# EAGLE design fanRegulator (EAGLE 7.6.0)

## Sheet 1 of 2
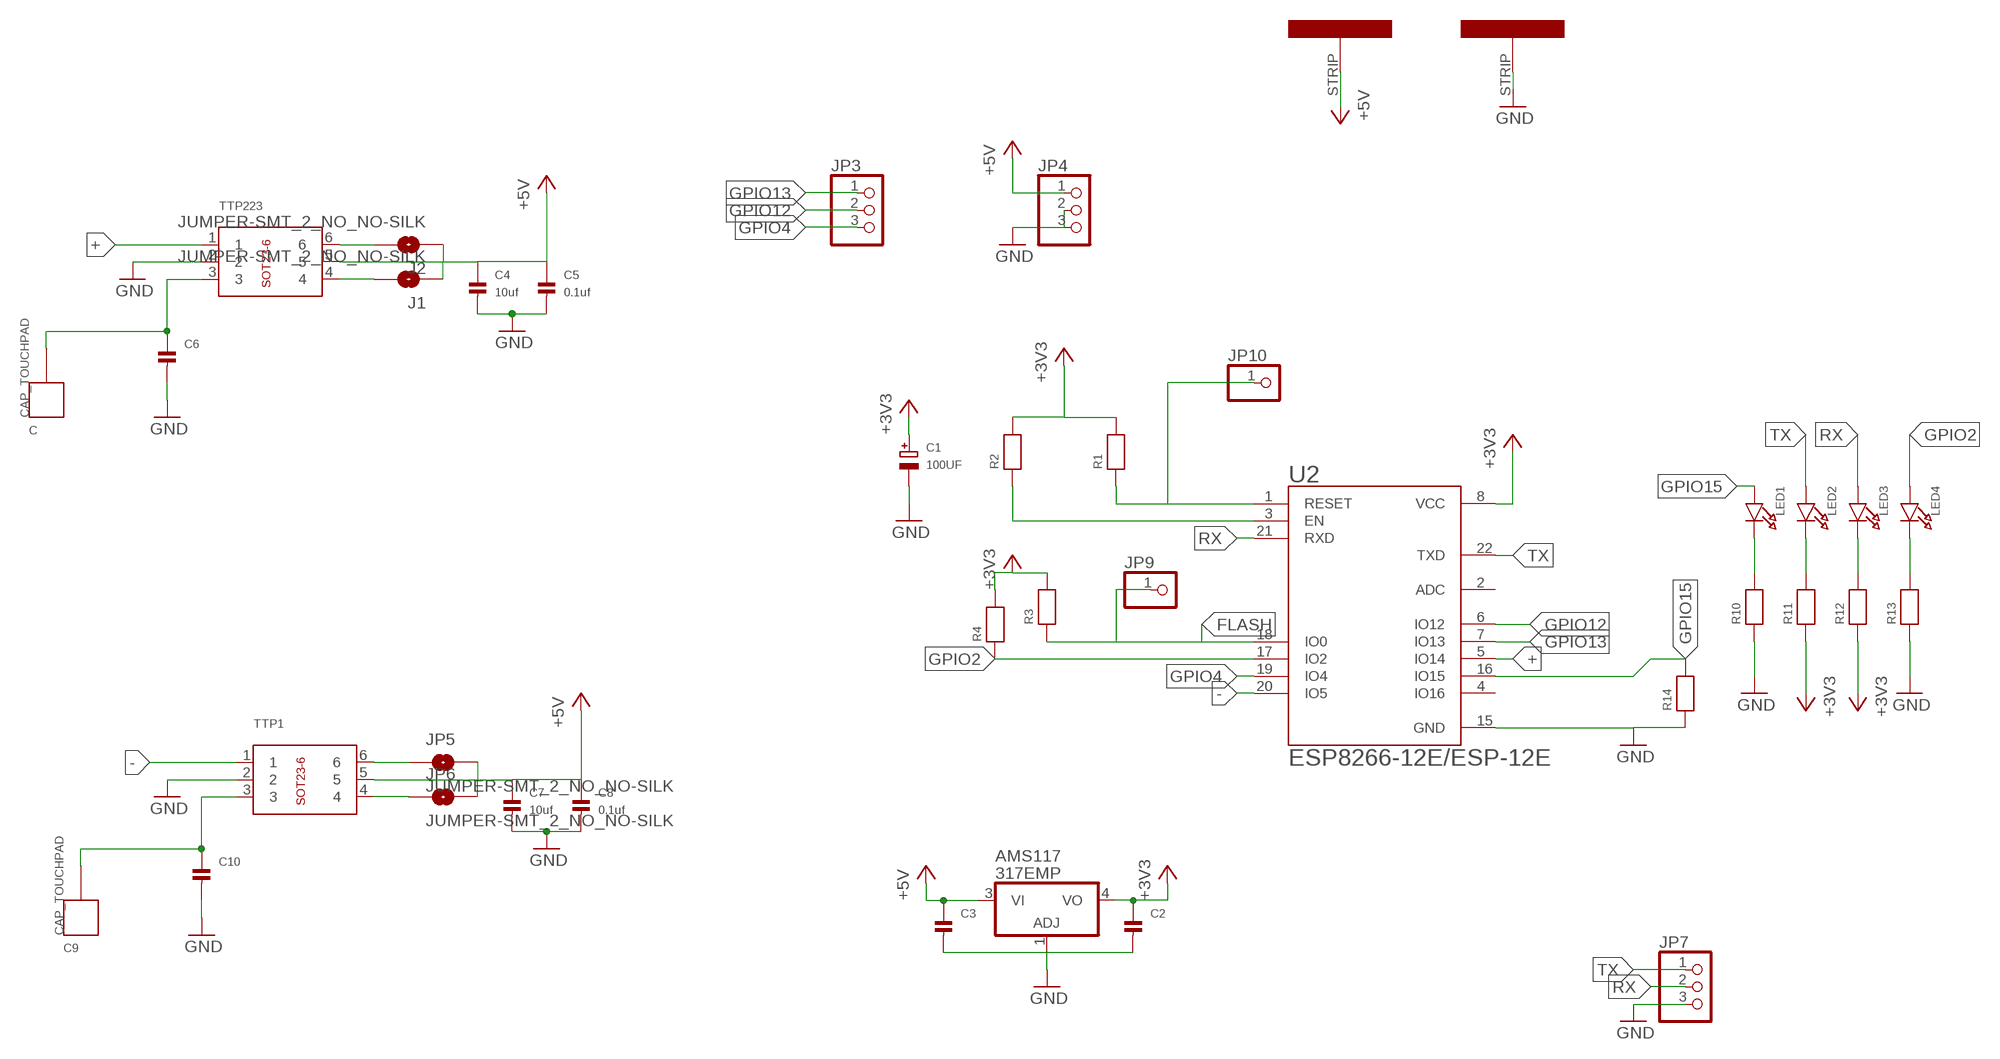
[diagram p0: schematic, sheet 1]

### Parts
AMS117  317EMP  [SOT223]
C  CAP_TOUCHPAD  [CAP_TOUCHPAD]
C1  100UF  CAP_TANTALUMC/6032_WAVE  [EIA6032-28/C-W]
C2  CAP_CERAMIC0805  [0805]
C3  CAP_CERAMIC0805  [0805]
C4  10uf  CAP_CERAMIC0805  [0805]
C5  0.1uf  CAP_CERAMIC0805  [0805]
C6  CAP_CERAMIC0805  [0805]
C7  10uf  CAP_CERAMIC0805  [0805]
C8  0.1uf  CAP_CERAMIC0805  [0805]
C9  CAP_TOUCHPAD  [CAP_TOUCHPAD]
C10  CAP_CERAMIC0805  [0805]
J1  JUMPER-SMT_2_NO_NO-SILK  [SMT-JUMPER_2_NO_NO-SILK]
J2  JUMPER-SMT_2_NO_NO-SILK  [SMT-JUMPER_2_NO_NO-SILK]
JP3  PINHD-1X3  [1X03]
JP4  PINHD-1X3  [1X03]
JP5  JUMPER-SMT_2_NO_NO-SILK  [SMT-JUMPER_2_NO_NO-SILK]
JP6  JUMPER-SMT_2_NO_NO-SILK  [SMT-JUMPER_2_NO_NO-SILK]
JP7  PINHD-1X3CB  [1X03-CLEANBIG]
JP9  PINHD-1X1  [1X01]
JP10  PINHD-1X1  [1X01]
LED1  LED0805  [CHIPLED_0805]
LED2  LED0805  [CHIPLED_0805]
LED3  LED0805  [CHIPLED_0805]
LED4  LED0805  [CHIPLED_0805]
R1  RESISTOR0805  [0805]
R2  RESISTOR0805  [0805]
R3  RESISTOR0805  [0805]
R4  RESISTOR0805  [0805]
R10  RESISTOR0805  [0805]
R11  RESISTOR0805  [0805]
R12  RESISTOR0805  [0805]
R13  RESISTOR0805  [0805]
R14  RESISTOR0805  [0805]
TTP1  BREAKOUT_SOT23-6  [BREAKOUT_SOT23-6]
TTP223  BREAKOUT_SOT23-6  [BREAKOUT_SOT23-6]
U2  ESP8266-12E/ESP-12E  [XCVR_ESP8266-12E/ESP-12E]
U$2  STRIP  [STRIP]
U$3  STRIP  [STRIP]

### Nets
+: TTP223.1 U2.5(IO14)
+3V3: AMS117.4(VO) C1.+ C2.1 R1.2 R2.2 R3.2 R4.2 R11.1 R12.1 U2.8(VCC)
+5V: AMS117.3(VI) C3.1 C4.1 C5.1 C7.1 C8.1 J1.1 J2.1 JP4.1 JP5.2 JP6.2 TTP1.5 TTP223.5 U$2.STRIP
-: TTP1.1 U2.20(IO5)
FLASH: JP9.1 R3.1 U2.18(IO0)
GND: AMS117.1(ADJ) C1.- C2.2 C3.2 C4.2 C5.2 C6.2 C7.2 C8.2 C10.2 JP4.2 JP4.3 JP7.3 R10.1 R13.1 R14.1 TTP1.2 TTP223.2 U2.15(GND) U$3.STRIP
GPIO2: LED4.A R4.1 U2.17(IO2)
GPIO4: JP3.3 U2.19(IO4)
GPIO12: JP3.2 U2.6(IO12)
GPIO13: JP3.1 U2.7(IO13)
GPIO15: LED1.A R14.2 U2.16(IO15)
N$2: C6.1 C.P$1 TTP223.3
N$3: JP10.1 R1.1 U2.1(RESET)
N$4: R2.1 U2.3(EN)
N$5: J2.2 TTP223.6
N$7: J1.2 TTP223.4
N$9: C9.P$1 C10.1 TTP1.3
N$10: JP5.1 TTP1.6
N$11: JP6.1 TTP1.4
N$19: LED1.C R10.2
N$20: LED2.C R11.2
N$21: LED3.C R12.2
N$24: LED4.C R13.2
RX: JP7.2 LED3.A U2.21(RXD)
TX: JP7.1 LED2.A U2.22(TXD)
Unconnected: U2.2(ADC) U2.4(IO16)

## Sheet 2 of 2
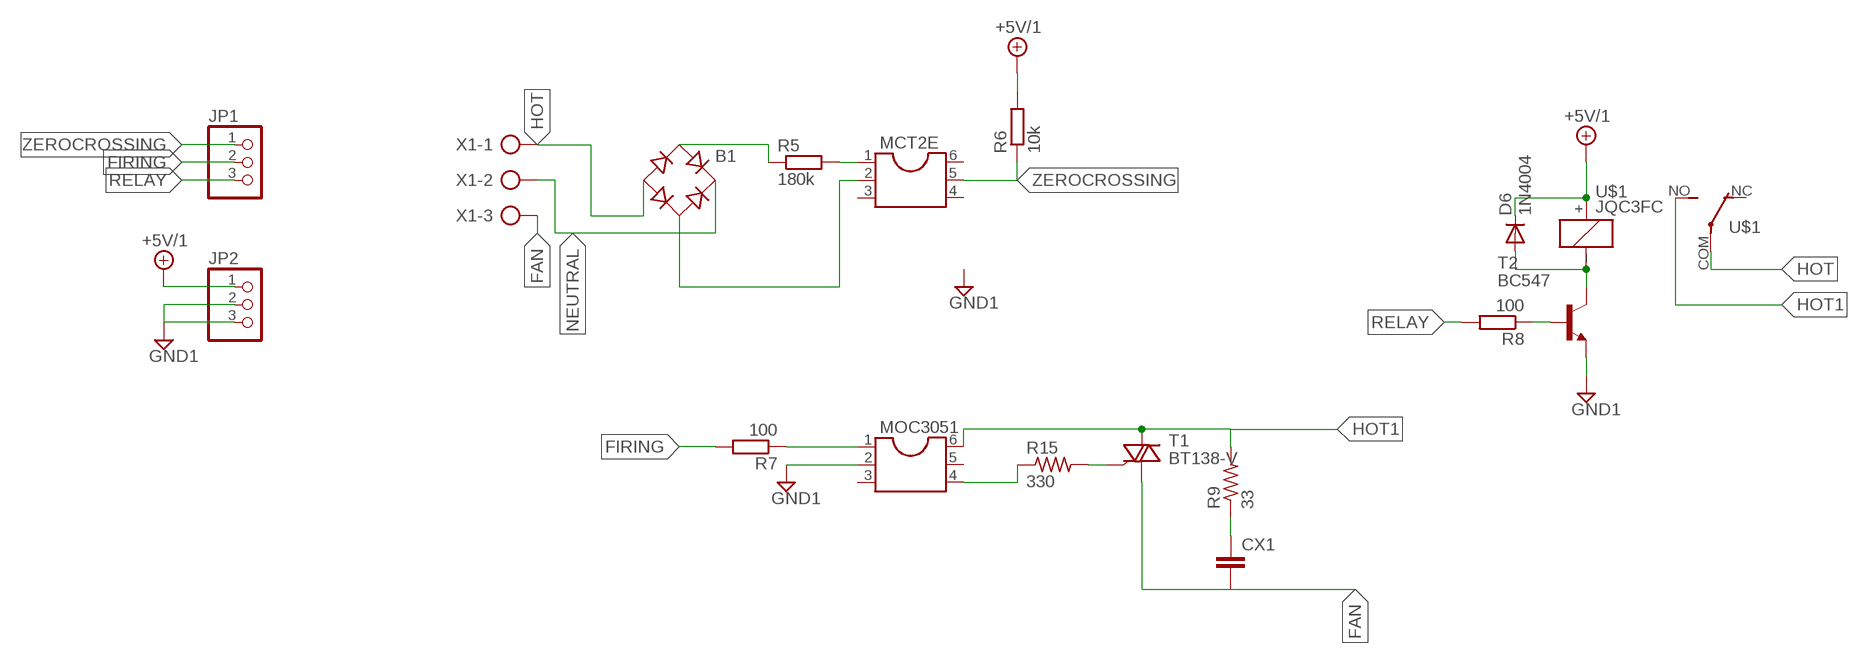
[diagram p1: schematic, sheet 2]

### Parts
B1  RB1A  [RB1A]
CX1  C-EU050-024X044  [C050-024X044]
D6  1N4004  [DO41-10]
JP1  PINHD-1X3  [1X03]
JP2  PINHD-1X3  [1X03]
MCT2E  DIL6  [DIL06]
MOC3051  DIL6  [DIL06]
R5  180k  R-EU_0309/V  [0309V]
R6  10k  R-EU_0204/2V  [0204V]
R7  100  R-EU_0204/2V  [0204V]
R8  100  R-EU_0204/2V  [0204V]
R9  33  R-US_0411/3V  [0411V]
R15  330  R-US_0207/2V  [0207/2V]
T1  BT138-V  [TO220BV]
T2  BC547  [TO92]
U$1  JQC3FC  [JQC3FC]
X1  AK500/3-H  [AK500/3-H]

### Nets
+5V/1: D6.C JP2.1 R6.2 U$1.+
FAN [AC]: CX1.2 T1.T1(A1) X1.3
FIRING: JP1.2 R7.2
GND1: JP2.2 JP2.3 MOC3051.2 T2.1(E)
HOT [AC]: B1.- U$1.COM X1.1
HOT1 [AC]: MOC3051.6 R9.2 T1.T2(A2) U$1.NO
N$1 [zerocross]: B1.AC1 R5.1
N$8 [zerocross]: B1.AC2 MCT2E.2
N$12 [zerocross]: MCT2E.1 R5.2
N$13: MOC3051.1 R7.1
N$14 [AC]: MOC3051.4 R15.1
N$15 [AC]: R15.2 T1.G
N$16 [AC]: CX1.1 R9.1
N$17: D6.A T2.3(C) U$1._(-)
N$18: R8.1 T2.2(B)
NEUTRAL [AC]: B1.+ X1.2
RELAY: JP1.3 R8.2
ZEROCROSSING: JP1.1 MCT2E.5 R6.1
Unconnected: MCT2E.3 MCT2E.4 MCT2E.6 MOC3051.3 MOC3051.5 U$1.NC

## Library data of the parts
AMS117 = linear:*317: Positive VOLTAGE REGULATOR
B1 = rectifier:RB1A: RECTIFIER 1 A
C C9 = Alfred:CAP_TOUCHPAD
C1 = microbuilder:CAP_TANTALUM: Tantalum Capacitors Wave footprints have larger pads and are meant to be used for hand soldering. Reflow footprints are optimised for solder paste and a reflow oven. EIA3216-18/A-[R/W] - Size A / 3216-18 / 1206 footprint 4.7µF 25V 10% Tantalum Capacitor 10µF 16V 10% Tantalum Capacitor [Digikey: 495-2236-2-ND] EIA3528-21/B-[R/W] - Size B / 3528-21 47µF 10V 10% Tantalum Capactior [Digikey: 495-2216-1-ND] EIA6032-28/C-[R/W] - Size C / 6032-28 10µF 35V 20% Tantalum Capacitor [Digikey: 495-2285-1-ND] 100µF 16V 10% Tantalum Capactior [Digikey: 399-5214-1-ND]
C2-C8 C10 = microbuilder:CAP_CERAMIC: Ceramic Capacitors 0402 - 0402 Surface Mount Capacitors 16pF 50V 5% [Digikey: 445-4899-2-ND] 18pF 50V 5% [Digikey: 490-1281-2-ND] 22pF 50V 5% [Digikey: 490-1283-2-ND] 68pF 50V 5% [Digikey: 490-1289-2-ND] 0.1uF 10V 10% [Digikey: 490-1318-2-ND] 1.0uF 6.3V 10% [Digikey: 490-1320-2-ND] 0603 - 0603 Surface Mount Capacitors 16 pF 50V 5% [Digikey: 445-5051-2-ND] 22 pF 50V [Digikey: PCC220ACVTR-ND] 33 pF 50V 5% [Digikey: 490-1415-1-ND] 56pF 50V 5% [Digikey: 490-1421-1-ND] 220pF 50V 5% [Digikey: 445-1285-1-ND] 680 pF 50V 2200 pF 50V 5% C0G [Digikey: 445-1297-1-ND] 5600 pF 100V 5% X7R [Digikey: 478-3711-1-ND] 0.1 µF 25V 10% [Digikey: PCC2277TR-ND] 0.22 µF 16V 10% X7R [Digikey: 445-1318-1-ND] 1.0 µF 25V 10% [Digikey: 445-5146-2-ND] 0603 - RF Specific 3pF 250V +/-0.1pF RF [Digikey: 712-1347-1-ND] 18 pF 250V 5% [Digikey: 478-3505-1-ND or 712-1322-1-ND] 56 pF 250V 5% C0G RF [Digikey: 490-4867-1-ND] 68 pF 250V RF [Digikey: 490-4868-1-ND] 0805 - 0805 Surface Mount Capacitors 220 pF 250V 2% RF Ceramic Capacitor [Digikey: 712-1398-1-ND] 1000 pF 50V 2% NP0 Ceramic Capacitor [Digikey: 478-3760-1-ND] 0.1 µF 25V 10% Ceramic Capacitor [Digikey: PCC1828TR-ND] 1.0 µF 16V 10% Ceramic Capacitor[Digikey: 490-1691-2-ND] 10.0 µF 10V 10% Ceramic Capacitor[Digikey: 709-1228-1-ND] 10.0 uF 16V 10% Ceramic Capacitor [Digikey: 478-5165-2-ND] 47 uF 6.3V 20% Ceramic Capacitor [Digikey: 587-1779-1-ND or 399-5506-1-ND] 1206 - 1206 Surface Mount Capacitors 47uF 10V 20% Ceramic Capacitor [Digikey: 490-5528-1-ND or 399-5508-1-ND or 445-6010-1-ND] 100uF 6.3V -20%, +80% Y5V Ceramic Capacitor (Digikey: 490-4512-1-ND, Mouser: 81-GRM31CF50J107ZE1L)
CX1 = resistor:C-EU: CAPACITOR, European symbol
D6 = adafruit:1N4004: DIODE General purpose 1N400x type rectifier (With bigger pads) http://www.ladyada.net/library/pcb/eaglelibrary.html
J1 J2 JP5 JP6 = SparkFun-Jumpers:JUMPER-SMT_2_NO: Normally open jumper This jumper has two pads in close proximity to each other. Apply solder to close the connection. Round pads are easier to solder for beginners, but are a lot larger. SparkFun Product that uses the round pads: SparkFun EL Sequencer <https://www.sparkfun.com/products/12781>
JP1-JP4 JP7 = adafruit:PINHD-1X3: PIN HEADER
JP9 JP10 = adafruit:PINHD-1X1: Pin header 1x1 for 0.1" spacing With round pins
LED1-LED4 = microbuilder:LED: LED 0603 - 0603 Surface Mount Package 2mA: Green LED - Low Power (3.9mcd, 2ma, 1.7Vf) - Digikey: 475-2709-2-ND Orange LED - Low Power (9.8mcd, 2ma, 1.8Vf) - Digikey: 475-1194-2-ND Red LED - Low Power (5mcd, 2ma, 1.8Vf) - Digikey: 475-1195-2-ND Yellow LED - Low Power (7mcd, 2ma, 1.8Vf) - Digikey: 475-1196-2-ND 5mA: Blue LED - Low Power (17mcd, 5ma, 2.9Vf) - Digikey: LNJ937W8CRACT-ND 0805 - 0805 Surface Mount Package 2mA: Red LED (8.8mcd, 2mA, 1.8Vf, Clear) - Low Power [Digikey: 475-2510-1-ND] Green LED (5mcd, 2mA, 1.8Vf, Clear) - Low Power [Digikey: 475-2730-1-ND] Yellow LED (11.3mcd, 2mA, 1.8Vf, Clear) - Low Power [Digikey: 475-2555-1-ND] 20mA: Red LED (104mcd, 20mA, Diffused) - LS R976 [Digikey: 475-1278-6-ND] Red LED (12mcd, 20mA, 2.0Vf, Clear) - APT2012EC [Digikey: 754-1128-1-ND] Green LED (15mcd, 20mA, 2.2Vf, Clear) - APT2012GC [Digikey: 754-1131-1-ND] Orange LED (160mcd, 20mA, 2.1Vf, Clear) - APT2012SECK [Digikey: 754-1130-1-ND] 1206 - 1206 Surface Mount Package Green LED (26mcd, 20mA, Diffused) - LG N971 [Digikey: 475-1407-6-ND] Red LED (15mcd, 20mA, Diffused) - LH N974 [Digikey: 475-1416-6-ND]
MCT2E MOC3051 = ic-package:DIL6: Dual In Line / Socket
R1-R4 R10-R14 = microbuilder:RESISTOR: Resistors 0402 - 0402 Surface Mount Package 22 Ohm 1% 1/16W [Digikey: 311-22.0LRTR-ND] 33 Ohm 5% 1/16W 1.0K 5% 1/16W 1.5K 5% 1/16W 2.0K 1% 1/16W 10.0K 1% 1/16W [Digikey: 311-10.0KLRTR-ND] 10.0K 5% 1/16W [Digikey: RMCF0402JT10K0TR-ND] 12.1K 1% 1/16W [Digikey: 311-22.0LRTR-ND] 100.0K 5% 1/16W 0603 - 0603 Surface Mount Package 0 Ohm 1/10 Watt 1% Resistor 15 Ohm 1/10 Watt 1% Resistor 33 Ohm 1/10 Watt 1% Resistor 49.9 Ohm 1/10 Watt 1% Resistor 100 Ohm 1/10 Watt 1% Resistor 150 Ohm 1/10 Watt 1% Resistor 240 Ohm 1/10 Watt 1% Resistor 390 Ohm 1/10 Watt 1% Resistor 560 Ohm 1/10 Watt 1% Resistor 680 Ohm 1/10 Watt 1% Resistor 750 Ohm 1/10 Watt 1% Resistor 1.0K Ohm 1/10 Watt 1% Resistor 1.5K Ohm 1/10 Watt 1% Resistor 2.0K Ohm 1/10 Watt 1% Resistor 2.2K Ohm 1/10 Watt 1% Resistor 3.3K Ohm 1/10 Watt 1% Resistor 4.7K Ohm 1/10 Watt 1% Resistor 10.0K Ohm 1/10 Watt 1% Resistor 12.0K Ohm 1/10 Watt 1% Resistor 12.1K Ohm 1/10 Watt 1% Resistor 20.0K Ohm 1/10 Watt 1% Resistor 33.0K Ohm 1/10 Watt 1% Resistor 100.0K Ohm 1/10 Watt 1% Resistor 0805 - 0805 Surface Mount Package 0 Ohm 1/8 Watt 1% Resistor 33 Ohm 1/8 Watt 1% Resistor 100 Ohm 1/8 Watt 1% Resistor 150 Ohm 1/8 Watt 1% Resistor 200 Ohm 1/8 Watt 1% Resistor 240 Ohm 1/8 Watt 1% Resistor 330 Ohm 1/8 Watt 1% Resistor 390 Ohm 1/8 Watt 1% Resistor 470 Ohm 1/8 Watt 1% Resistor 1.0K Ohm 1/8 Watt 1% Resistor 1.5K Ohm 1/8 Watt 1% Resistor 2.0K Ohm 1/8 Watt 1% Resistor 4.7K Ohm 1/8 Watt 1% Resistor 5.1K Ohm 1/8 Watt 1% Resistor 5.6K Ohm 1/8 Watt 1% Resistor 10.0K Ohm 1/8 Watt 1% Resistor 22.0K Ohm 1/8 Watt 1% Resistor 33.0K Ohm 1/8 Watt 1% Resistor 100K Ohm 1/8 Watt 1% Resistor 1206 - 1206 Surface Mount Package 2012 - 2010 Surface Mount Package 0.11 Ohm 1/2 Watt 1% Resistor - Digikey: RHM.11UCT-ND
R5-R8 = rcl:R-EU_: RESISTOR, European symbol
R9 R15 = adafruit:R-US_: RESISTOR, American symbol
T1 = triac:BT138: TRIAC Source: http://www.semiconductors.philips.com BT138_SERIES_2.pdf
T2 = transistor:BC547: NPN TRANSISTOR
TTP1 TTP223 = microbuilder:BREAKOUT_SOT23-6: IC Breakout SOT23-6
U2 = ESP8266-12E_ESP-12E:ESP8266-12E/ESP-12E: ESP-12E WiFi Module; AVAILABILITY: Unavailable; DESCRIPTION: This WiFi module has a 32-bit MCU micro and clock speeds supporting 80 MHz or 160 MHz. Supports the RTOS and integrated Wi-Fi MAC/BB/RF/PA/LNA, and has an on-board antenna.; MF: AI-Thinker; MP: ESP8266-12E/ESP-12E; PACKAGE: None; PRICE: None
U$1 = Alfred:JQC3FC
U$2 U$3 = Alfred:STRIP
X1 = con-ptr500:AK500/3-H: CONNECTOR Aug. 2004 / PTR Meßtechnik: Die Bezeichnung der Serie AK505 wurde geändert. Es handelt sich hierbei um AK500 in horizontaler Ausführung.; OC_FARNELL: unknown; OC_NEWARK: unknown

## Net classes
0 default: width 0.4 mm, clearance 0.381 mm
1 AC: width 1.5 mm, clearance 0.381 mm to class 0, clearance 0.381 mm
3 zerocross: width 0.35 mm, drill 0.7 mm, clearance 0.5 mm to class 0, clearance 0.5 mm to class 1, clearance 0.5 mm to class 2, clearance 0.3 mm

## Board
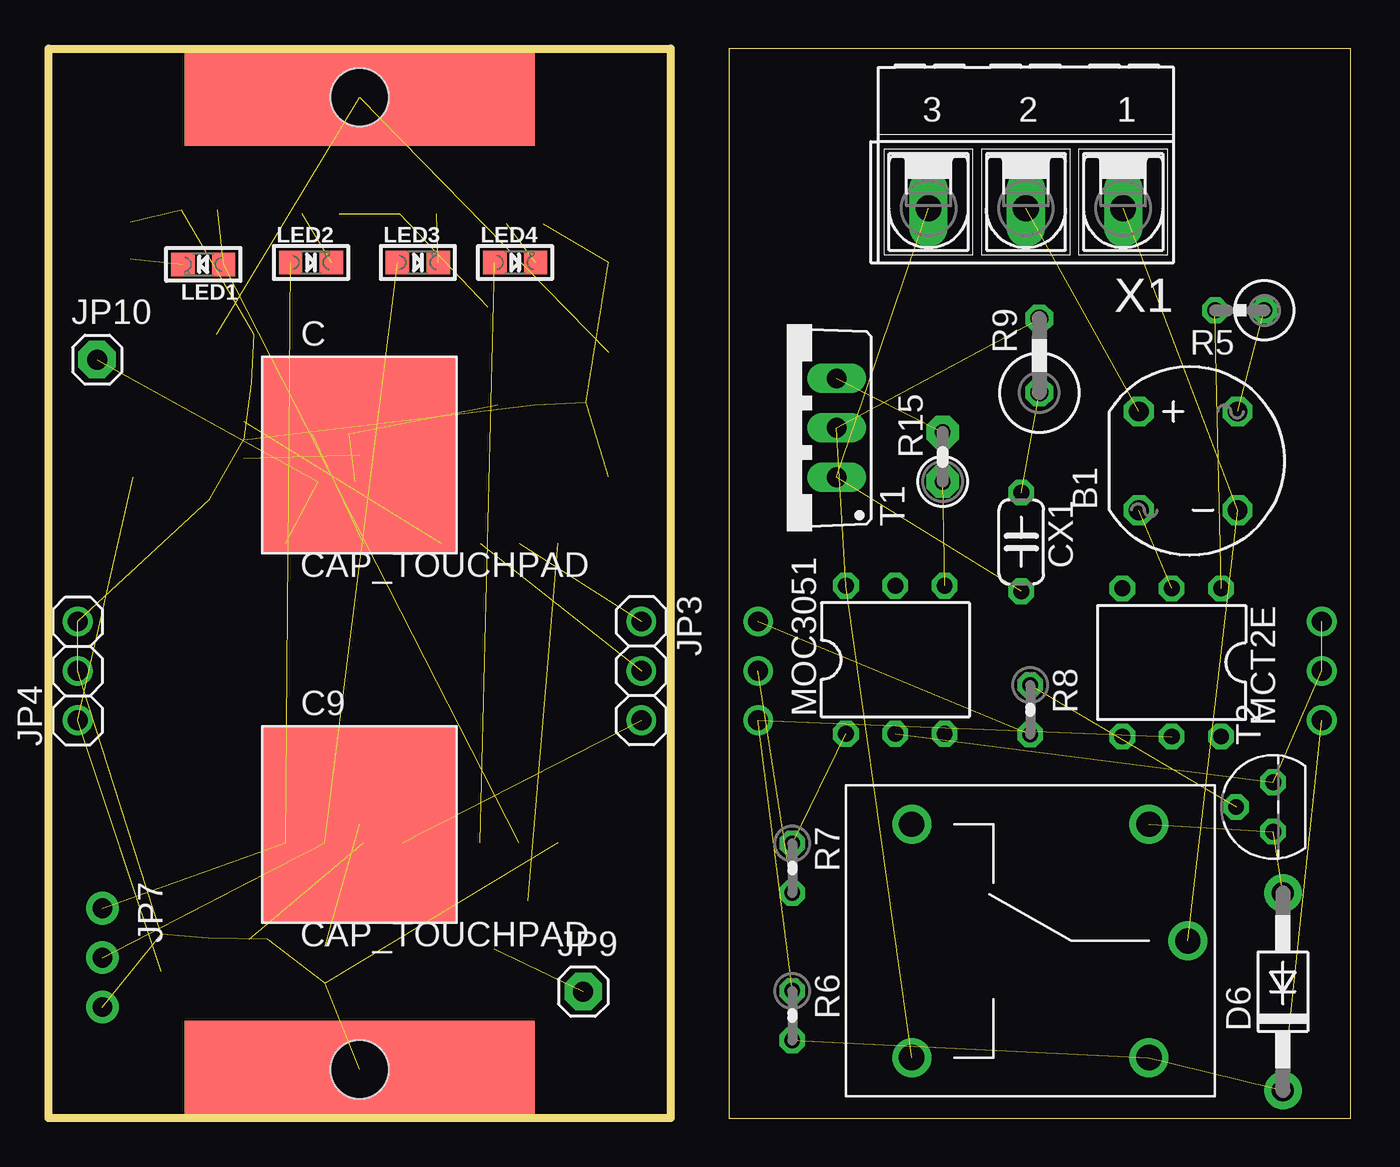
[diagram p2: board, top side]
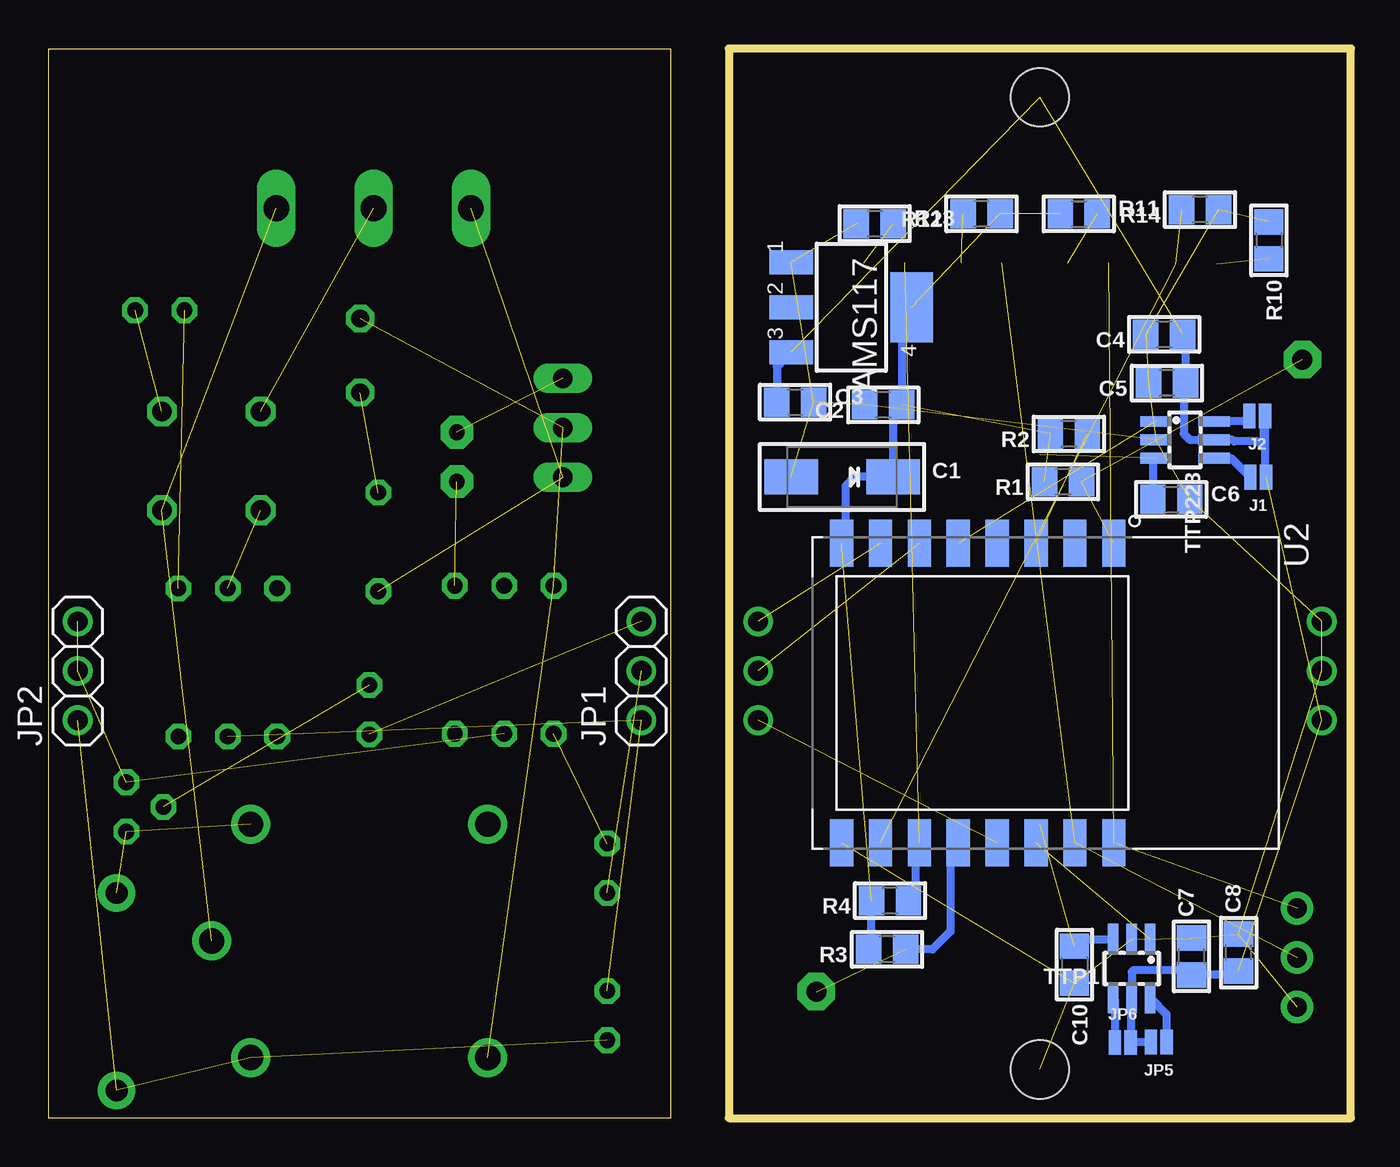
[diagram p3: board, bottom side, seen from below]

Size 67 x 55 mm. Coordinates in mm from the lower left corner, seen from the top.
Outline: 35,0 67,0 67,55 35,55 35,0
Outline: 0,0 0,55 32,55 32,0 0,0
Copper layers (1*16): Top 0.035mm / dielectric 1.5mm / Bottom 0.035mm
Design rules "default": minimum track width 10mil, minimum drill 24mil, track to track 8mil, track to pad 8mil, pad to pad 8mil, via to via 8mil, smd to smd 8mil, copper to edge 40mil, drill to drill 8mil, minimum pad ring 10mil, minimum via ring 8mil, stop-mask expansion 4mil, vias tented up to drill 0mil, thermal gap 10mil

### Footprints (pad centres in the part's own frame; a part is rotated, then mirrored left to right if it is on the bottom)
SOT223 = smd 1.219 x 2.235: 1 -2.311,-3.099; 2 0,-3.099; 3 2.311,-3.099 | smd 3.6 x 2.2: 4 0,3.099
RB1A = drill 1.016 octagon: + -2.54,2.54; - 2.54,-2.54; AC1 2.54,2.54; AC2 -2.54,-2.54
CAP_TOUCHPAD = smd 10 x 10: P$1 0,0
EIA6032-28/C-W = smd 2.75 x 1.8: + 2.625,0; - -2.625,0
0805 = smd 1.3 x 1.5: 1 -0.95,0; 2 0.95,0
C050-024X044 = drill 0.813 octagon: 1 -2.54,0; 2 2.54,0
DO41-10 = drill 1.118 pad 1.93: A 5.08,0; C -5.08,0
SMT-JUMPER_2_NO_NO-SILK = smd 0.635 x 1.27: 1 -0.406,0; 2 0.406,0
1X03 = drill 1.016: 1 -2.54,0; 2 0,0; 3 2.54,0
1X03-CLEANBIG = drill 1.016 pad 1.676: 1 -2.54,0; 2 0,0; 3 2.54,0
1X01 = drill 1.016 pad 1.93 octagon: 1 0,0
CHIPLED_0805 = smd 1.2 x 1.2: A 0,-1.05; C 0,1.05
DIL06 = drill 0.813 octagon: 1 -2.54,-3.81; 2 0,-3.81; 3 2.54,-3.81; 4 2.54,3.81; 5 0,3.81; 6 -2.54,3.81
0309V = drill 0.813 octagon: 1 -1.27,0; 2 1.27,0
0204V = drill 0.813 octagon: 1 -1.27,0; 2 1.27,0
0411V = drill 0.914 octagon: 1 -2.54,0; 2 1.27,0
0207/2V = drill 0.813 pad 1.676 octagon: 1 -1.27,0; 2 1.27,0
TO220BV = drill 1.016 long: G 2.54,-2.54; T1 -2.54,-2.54; T2 0,-2.54
TO92 = drill 0.813 octagon: 1 1.27,0; 2 0,1.905; 3 -1.27,0
BREAKOUT_SOT23-6 = smd 0.55 x 1.6: 1 -0.95,-1.5; 2 0,-1.5; 3 0.95,-1.5; 4 0.95,1.5; 5 0,1.5; 6 -0.95,1.5
XCVR_ESP8266-12E/ESP-12E = smd 2.4 x 1.2: 1 -7.7,7; 2 -7.7,5; 3 -7.7,3; 4 -7.7,1; 5 -7.7,-1; 6 -7.7,-3; 7 -7.7,-5; 8 -7.7,-7; 15 7.7,-7; 16 7.7,-5; 17 7.7,-3; 18 7.7,-1; 19 7.7,1; 20 7.7,3; 21 7.7,5; 22 7.7,7
JQC3FC = drill 1.3 pad 2: + -6.2,6; _ -6.2,-6; COM -8.2,0; NC 6,-6; NO 6,6
STRIP = smd 18 x 5: STRIP 0,0 | hole 3: 0,0
AK500/3-H = drill 1.321 long: 1 -5.004,0; 2 0,0; 3 5.004,0

### Placement (x,y rotation side)
AMS117  25.7,41.7 270 bottom
B1  58.63,33.8 0 top
C  16,34.1 0 top
C1  26.18,32.97 0 bottom
C2  24.06,36.68 180 bottom
C3  28.59,36.82 0 bottom
C4  9.61,40.3 180 bottom
C5  9.46,37.8 180 bottom
C6  9.24,31.82 0 bottom
C7  8.2,8.31 90 bottom
C8  5.78,8.51 90 bottom
C9  16,15.1 0 top
C10  14.22,7.89 270 bottom
CX1  50.04,29.63 270 top
D6  63.5,6.5 90 top
J1  4.77,32.96 180 bottom
J2  4.82,36.11 180 bottom
JP1  36.5,23 90 bottom
JP2  65.5,23 90 bottom
JP3  30.5,23 270 top
JP4  1.5,23 90 top
JP5  9.89,3.91 180 bottom
JP6  11.74,3.89 0 bottom
JP7  2.77,8.25 270 top
JP9  27.5,6.5 0 top
JP10  2.5,39 0 top
LED1  7.96,43.9 90 top
LED2  13.5,44 270 top
LED3  19,44 270 top
LED4  24,44 270 top
MCT2E  57.78,23.43 180 top
MOC3051  43.56,23.57 0 top
R1  14.81,32.72 180 bottom
R2  14.51,35.18 180 bottom
R3  23.86,8.68 180 bottom
R4  23.71,11.18 180 bottom
R5  61.28,41.54 180 top
R6  38.26,5.27 270 top
R7  38.26,12.85 270 top
R8  50.5,21 270 top
R9  50.97,39.85 90 top
R10  4.22,45.14 270 bottom
R11  14,46.5 0 bottom
R12  19,46.5 180 bottom
R13  24.5,46 0 bottom
R14  7.76,46.72 180 bottom
R15  46,34 90 top
T1  38,35.5 90 top
T2  63,16 90 top
TTP1  11.28,7.69 180 bottom
TTP223  8.54,34.88 270 bottom
U2  19.2,21.86 270 bottom
U$1  50.41,9.11 180 top
U$2  16,52.5 0 top
U$3  16,2.5 0 top
X1  50.28,46.79 180 top

### Tracks (layer width: path | path; a pad name or v marks a point on that pad's centre or on a via)
+  (1 unrouted)
+3V3  (5 unrouted)
  Bottom 0.406: R3.2 24.66,8.83 R4.2 | U2.8 26,29.76 26,32.5 25.53,32.97 C1.+ 23.55,36.23 C2.1 23.11,41.19 AMS117.4
+5V  (4 unrouted)
  Bottom 0.406: J1.1 4.41,33.01 J2.1 4.5,36.02 4.5,34.5 4.8,34.8 6,34.8 6.08,34.88 TTP223.5 8.28,34.88 8.6,35.2 8.6,37.71 C5.1 8.51,40.15 C4.1 | JP5.2 10.32,3.89 JP6.2 11.33,6.14 TTP1.5 11.28,7.52 11.2,7.6 8.44,7.6 C7.1 5.98,7.36 C8.1 | AMS117.3 29.54,38.65 C3.1
+5V/1  (3 unrouted)
-  (1 unrouted)
FAN  (2 unrouted)
FIRING  (1 unrouted)
FLASH  (1 unrouted)
  Bottom 0.406: U2.18 20.6,13.96 20.6,9.6 21.52,8.68 R3.1
GND  (19 unrouted)
GND1  (3 unrouted)
GPIO2  (1 unrouted)
  Bottom 0.406: U2.17 22.4,14.16 22.4,12 22.76,11.64 R4.1
GPIO4  (1 unrouted)
GPIO12  (1 unrouted)
GPIO13  (1 unrouted)
GPIO15  (2 unrouted)
HOT  (2 unrouted)
HOT1  (3 unrouted)
N$1  (1 unrouted)
N$2  (1 unrouted)
  Bottom 0.406: TTP223.3 10.19,33.78 C6.1
N$3  (2 unrouted)
N$4  (1 unrouted)
N$5
  Bottom 0.406: J2.2 5.45,35.83 TTP223.6
N$7
  Bottom 0.406: J1.2 6.15,33.93 TTP223.4
N$8  (1 unrouted)
N$9  (1 unrouted)
  Bottom 0.406: C10.1 13.87,9.19 TTP1.3
N$10
  Bottom 0.406: TTP1.6 9.48,5.34 JP5.1
N$11
  Bottom 0.406: TTP1.4 12.15,6.11 JP6.1
N$12  (1 unrouted)
N$13  (1 unrouted)
N$14  (1 unrouted)
N$15  (1 unrouted)
N$16  (1 unrouted)
N$17  (2 unrouted)
N$18  (1 unrouted)
N$19  (1 unrouted)
N$20  (1 unrouted)
N$21  (1 unrouted)
N$24  (1 unrouted)
NEUTRAL  (1 unrouted)
RELAY  (1 unrouted)
RX  (2 unrouted)
TX  (2 unrouted)
ZEROCROSSING  (2 unrouted)